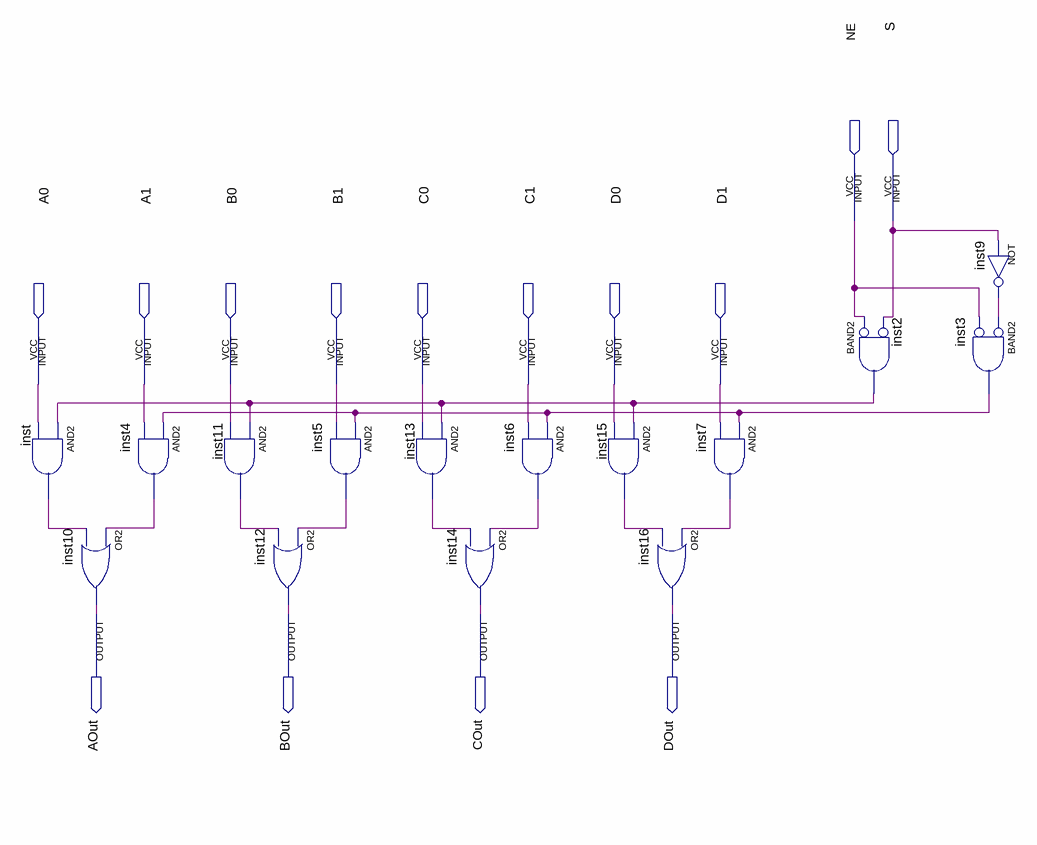
[diagram p0: schematic sheet]
// Quartus schematic CI74157.bdf as structural Verilog: 15 symbols, 14 pins
module CI74157 (
  input  NE,
  input  S,
  input  A0,
  input  A1,
  input  B0,
  input  B1,
  input  C0,
  input  C1,
  input  D0,
  input  D1,
  output AOut,
  output BOut,
  output COut,
  output DOut
);

  wire inst2_out, inst3_out, inst4_out, inst5_out, inst6_out, inst7_out, inst9_out, inst11_out, inst13_out,
       inst15_out, inst_out;

  and inst (inst_out, inst2_out, A0);
  or inst10 (AOut, inst4_out, inst_out);
  and inst4 (inst4_out, inst3_out, A1);
  and inst11 (inst11_out, inst2_out, B0);
  and inst5 (inst5_out, inst3_out, B1);
  or inst12 (BOut, inst5_out, inst11_out);
  and inst13 (inst13_out, inst2_out, C0);
  or inst14 (COut, inst6_out, inst13_out);
  and inst6 (inst6_out, inst3_out, C1);
  and inst15 (inst15_out, inst2_out, D0);
  and inst7 (inst7_out, inst3_out, D1);
  or inst16 (DOut, inst7_out, inst15_out);
  and inst2 (inst2_out, ~NE, ~S);  // BAND2
  not inst9 (inst9_out, S);
  and inst3 (inst3_out, ~inst9_out, ~NE);  // BAND2
endmodule
